# EAGLE design sa_input (EAGLE 9.6.2)
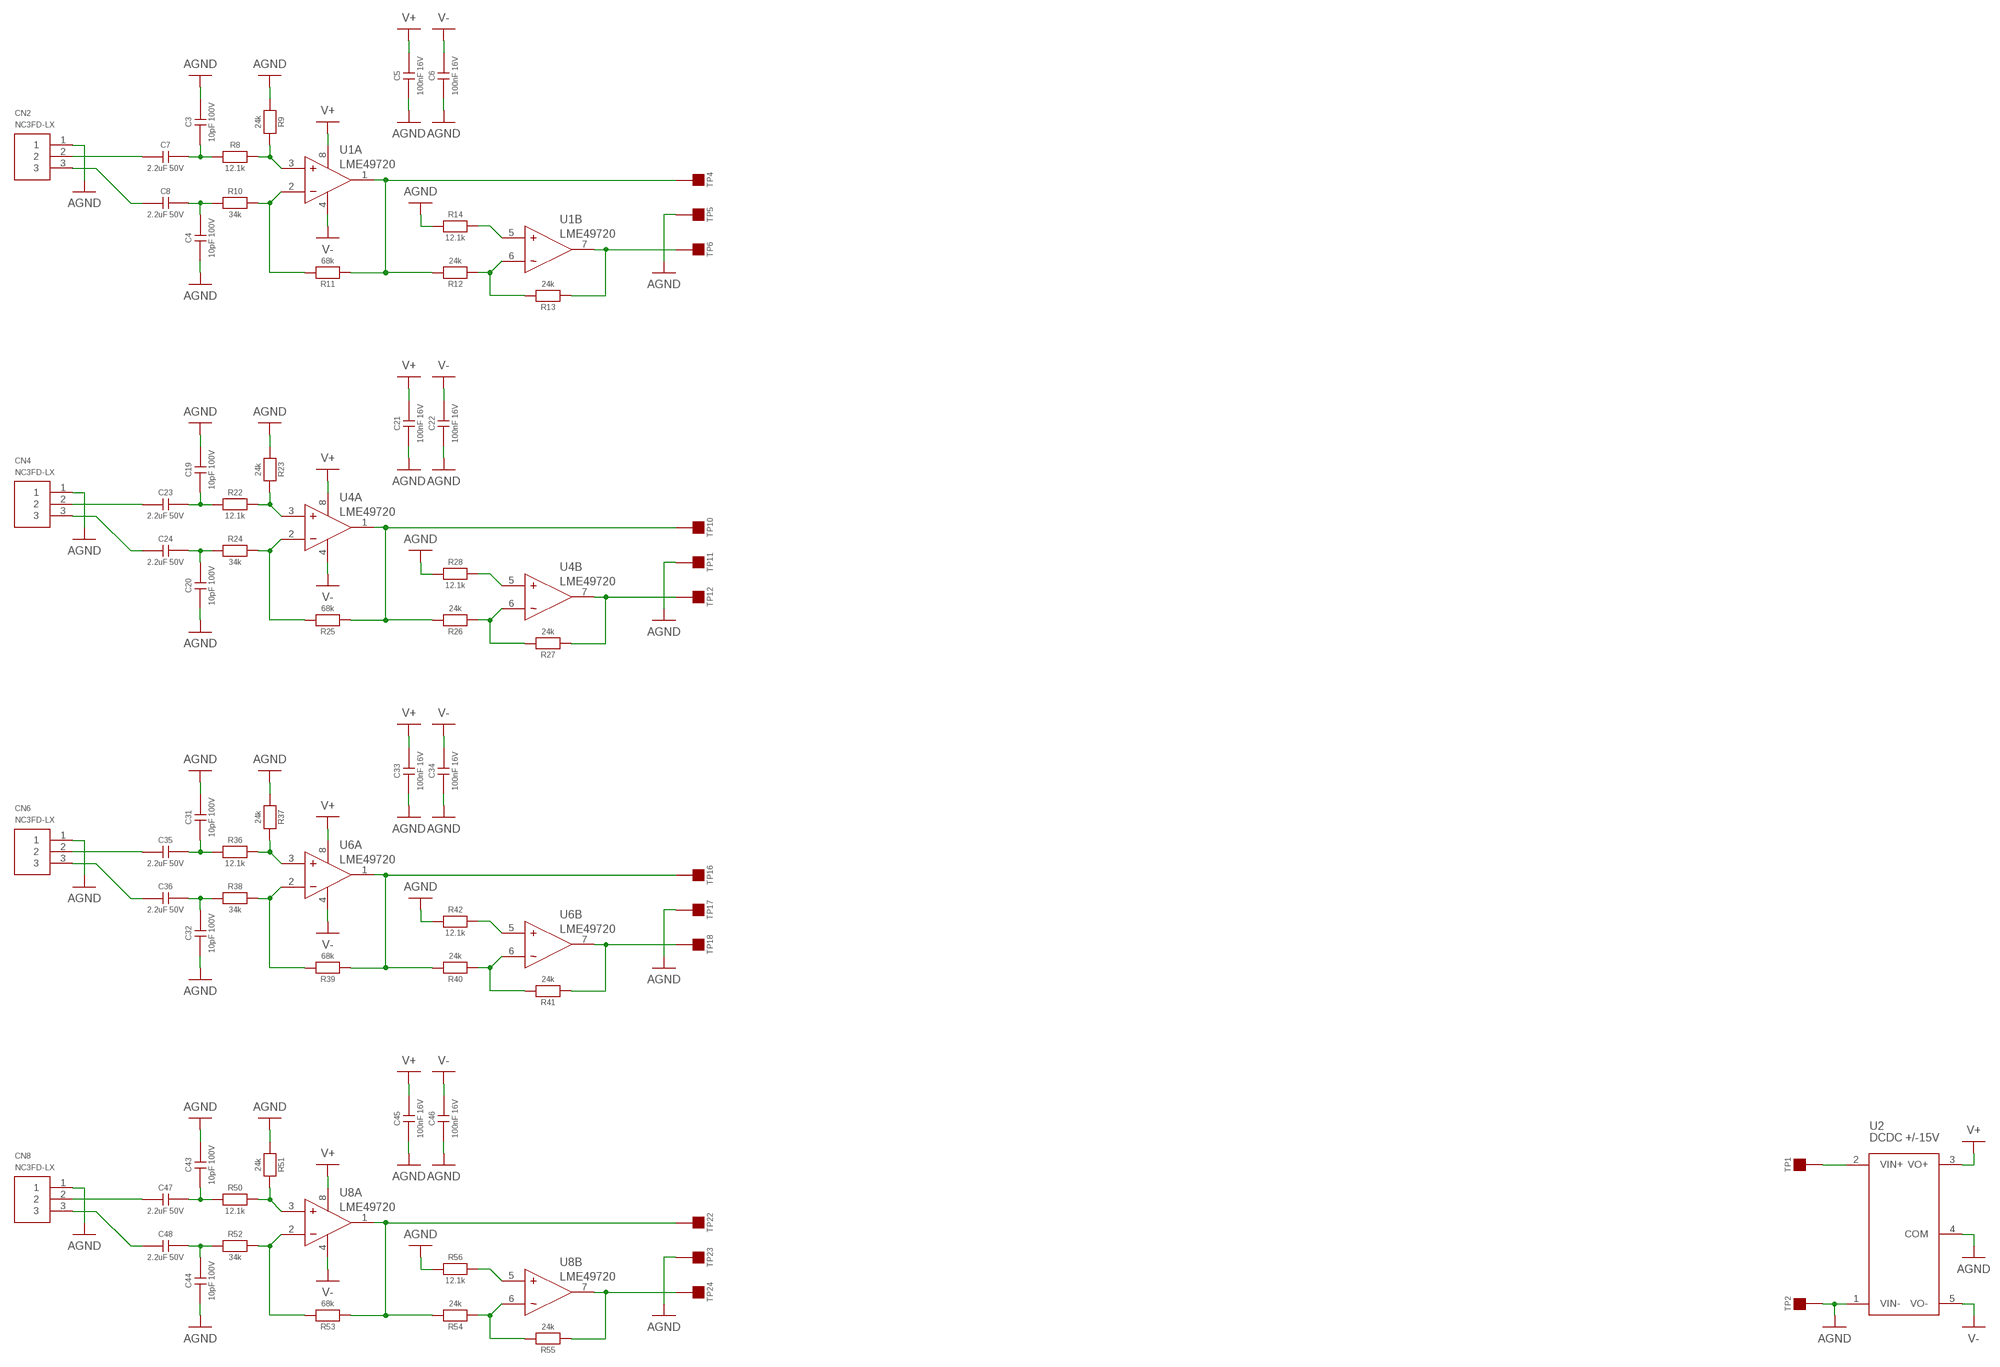
[diagram p0: schematic, sheet 1, part 1 of 2]
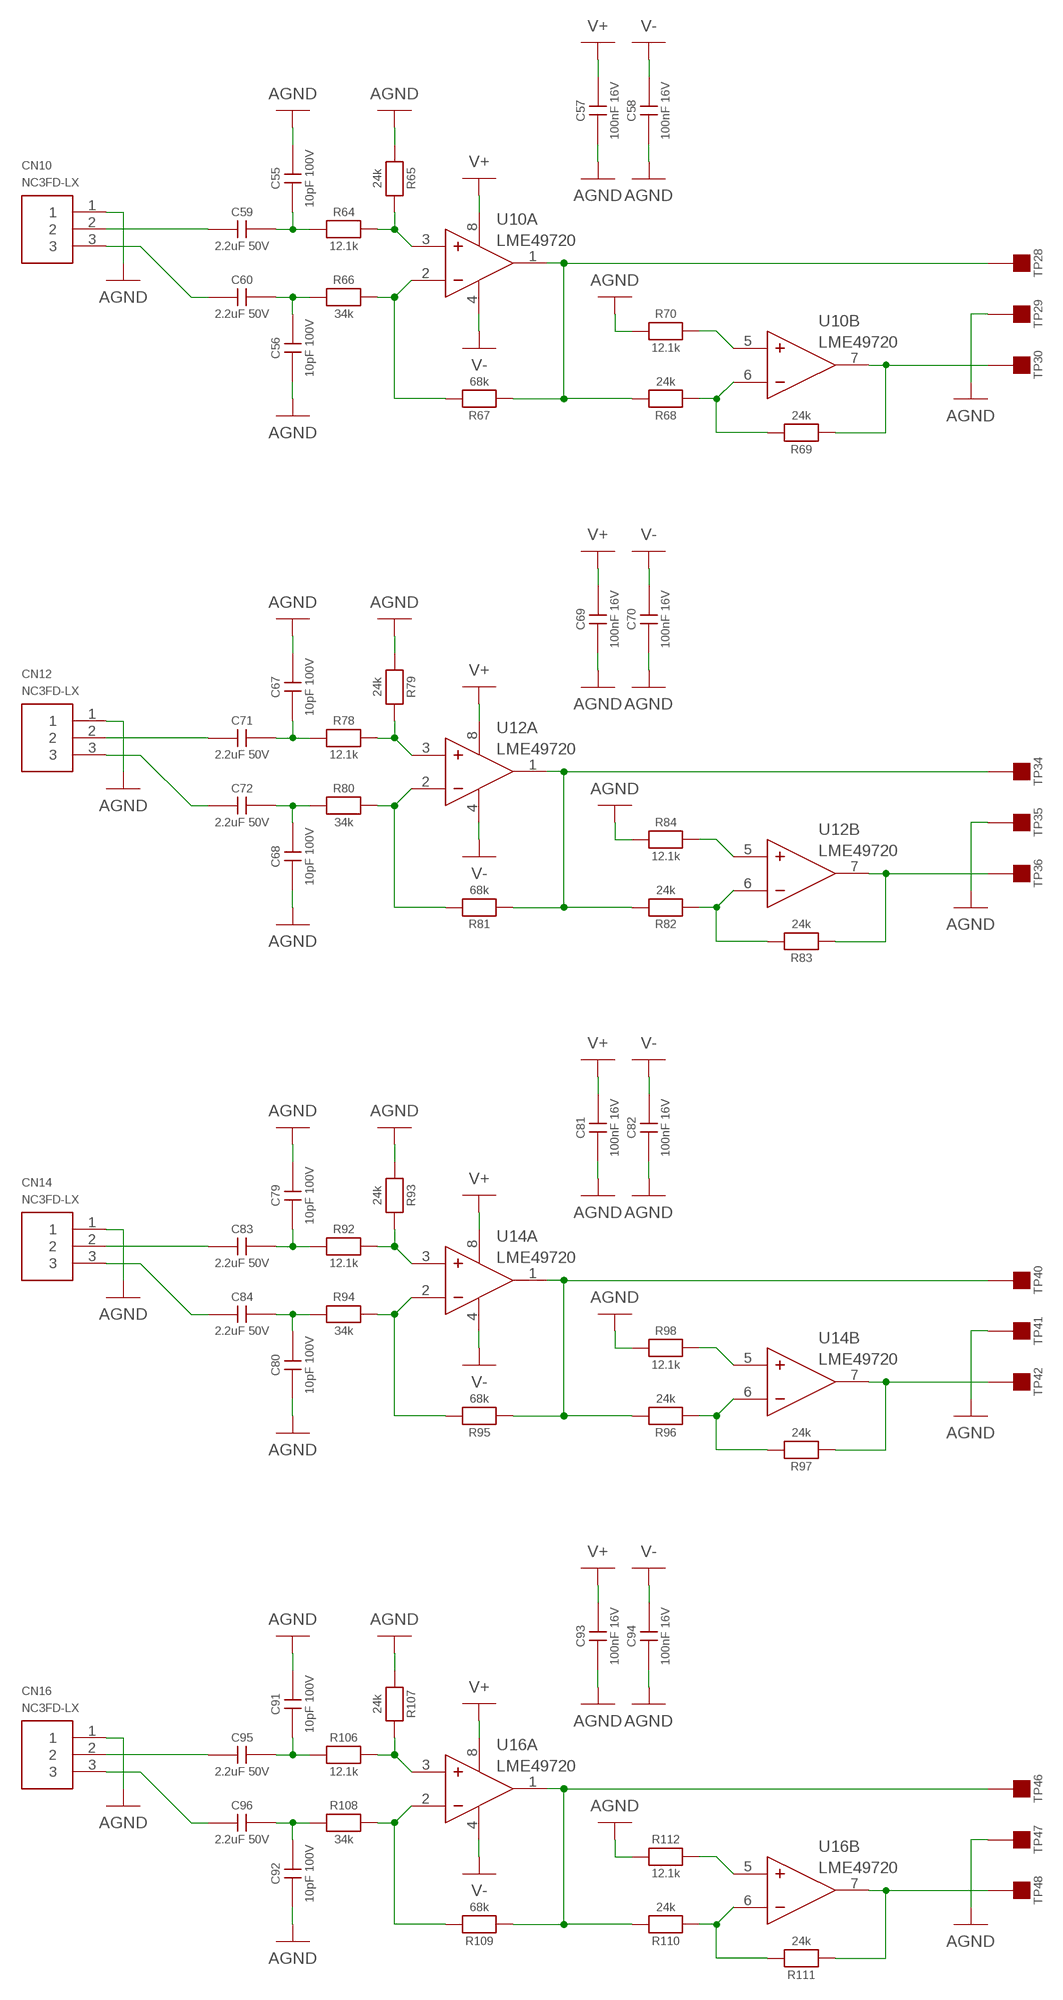
[diagram p1: schematic, sheet 1, part 2 of 2]

## Parts
C3  10pF 100V  06031A100FAT2A  [0603]
C4  10pF 100V  06031A100FAT2A  [0603]
C5  100nF 16V  CL10B104KO8WPNC  [0603]
C6  100nF 16V  CL10B104KO8WPNC  [0603]
C7  2.2uF 50V  MKS2B042201F00KSSD  [5X7.2BOX]
C8  2.2uF 50V  MKS2B042201F00KSSD  [5X7.2BOX]
C19  10pF 100V  06031A100FAT2A  [0603]
C20  10pF 100V  06031A100FAT2A  [0603]
C21  100nF 16V  CL10B104KO8WPNC  [0603]
C22  100nF 16V  CL10B104KO8WPNC  [0603]
C23  2.2uF 50V  MKS2B042201F00KSSD  [5X7.2BOX]
C24  2.2uF 50V  MKS2B042201F00KSSD  [5X7.2BOX]
C31  10pF 100V  06031A100FAT2A  [0603]
C32  10pF 100V  06031A100FAT2A  [0603]
C33  100nF 16V  CL10B104KO8WPNC  [0603]
C34  100nF 16V  CL10B104KO8WPNC  [0603]
C35  2.2uF 50V  MKS2B042201F00KSSD  [5X7.2BOX]
C36  2.2uF 50V  MKS2B042201F00KSSD  [5X7.2BOX]
C43  10pF 100V  06031A100FAT2A  [0603]
C44  10pF 100V  06031A100FAT2A  [0603]
C45  100nF 16V  CL10B104KO8WPNC  [0603]
C46  100nF 16V  CL10B104KO8WPNC  [0603]
C47  2.2uF 50V  MKS2B042201F00KSSD  [5X7.2BOX]
C48  2.2uF 50V  MKS2B042201F00KSSD  [5X7.2BOX]
C55  10pF 100V  06031A100FAT2A  [0603]
C56  10pF 100V  06031A100FAT2A  [0603]
C57  100nF 16V  CL10B104KO8WPNC  [0603]
C58  100nF 16V  CL10B104KO8WPNC  [0603]
C59  2.2uF 50V  MKS2B042201F00KSSD  [5X7.2BOX]
C60  2.2uF 50V  MKS2B042201F00KSSD  [5X7.2BOX]
C67  10pF 100V  06031A100FAT2A  [0603]
C68  10pF 100V  06031A100FAT2A  [0603]
C69  100nF 16V  CL10B104KO8WPNC  [0603]
C70  100nF 16V  CL10B104KO8WPNC  [0603]
C71  2.2uF 50V  MKS2B042201F00KSSD  [5X7.2BOX]
C72  2.2uF 50V  MKS2B042201F00KSSD  [5X7.2BOX]
C79  10pF 100V  06031A100FAT2A  [0603]
C80  10pF 100V  06031A100FAT2A  [0603]
C81  100nF 16V  CL10B104KO8WPNC  [0603]
C82  100nF 16V  CL10B104KO8WPNC  [0603]
C83  2.2uF 50V  MKS2B042201F00KSSD  [5X7.2BOX]
C84  2.2uF 50V  MKS2B042201F00KSSD  [5X7.2BOX]
C91  10pF 100V  06031A100FAT2A  [0603]
C92  10pF 100V  06031A100FAT2A  [0603]
C93  100nF 16V  CL10B104KO8WPNC  [0603]
C94  100nF 16V  CL10B104KO8WPNC  [0603]
C95  2.2uF 50V  MKS2B042201F00KSSD  [5X7.2BOX]
C96  2.2uF 50V  MKS2B042201F00KSSD  [5X7.2BOX]
CN2  NC3FD-LX  [NC3FD-LX]
CN4  NC3FD-LX  [NC3FD-LX]
CN6  NC3FD-LX  [NC3FD-LX]
CN8  NC3FD-LX  [NC3FD-LX]
CN10  NC3FD-LX  [NC3FD-LX]
CN12  NC3FD-LX  [NC3FD-LX]
CN14  NC3FD-LX  [NC3FD-LX]
CN16  NC3FD-LX  [NC3FD-LX]
R8  12.1k  CRCW060312K1FKEB  [0603]
R9  24k  CRCW060324K0FKEA  [0603]
R10  34k  CRCW060334K0FKEA  [0603]
R11  68k  CRCW060368K0FKEA  [0603]
R12  24k  CRCW060324K0FKEA  [0603]
R13  24k  CRCW060324K0FKEA  [0603]
R14  12.1k  CRCW060312K1FKEB  [0603]
R22  12.1k  CRCW060312K1FKEB  [0603]
R23  24k  CRCW060324K0FKEA  [0603]
R24  34k  CRCW060334K0FKEA  [0603]
R25  68k  CRCW060368K0FKEA  [0603]
R26  24k  CRCW060324K0FKEA  [0603]
R27  24k  CRCW060324K0FKEA  [0603]
R28  12.1k  CRCW060312K1FKEB  [0603]
R36  12.1k  CRCW060312K1FKEB  [0603]
R37  24k  CRCW060324K0FKEA  [0603]
R38  34k  CRCW060334K0FKEA  [0603]
R39  68k  CRCW060368K0FKEA  [0603]
R40  24k  CRCW060324K0FKEA  [0603]
R41  24k  CRCW060324K0FKEA  [0603]
R42  12.1k  CRCW060312K1FKEB  [0603]
R50  12.1k  CRCW060312K1FKEB  [0603]
R51  24k  CRCW060324K0FKEA  [0603]
R52  34k  CRCW060334K0FKEA  [0603]
R53  68k  CRCW060368K0FKEA  [0603]
R54  24k  CRCW060324K0FKEA  [0603]
R55  24k  CRCW060324K0FKEA  [0603]
R56  12.1k  CRCW060312K1FKEB  [0603]
R64  12.1k  CRCW060312K1FKEB  [0603]
R65  24k  CRCW060324K0FKEA  [0603]
R66  34k  CRCW060334K0FKEA  [0603]
R67  68k  CRCW060368K0FKEA  [0603]
R68  24k  CRCW060324K0FKEA  [0603]
R69  24k  CRCW060324K0FKEA  [0603]
R70  12.1k  CRCW060312K1FKEB  [0603]
R78  12.1k  CRCW060312K1FKEB  [0603]
R79  24k  CRCW060324K0FKEA  [0603]
R80  34k  CRCW060334K0FKEA  [0603]
R81  68k  CRCW060368K0FKEA  [0603]
R82  24k  CRCW060324K0FKEA  [0603]
R83  24k  CRCW060324K0FKEA  [0603]
R84  12.1k  CRCW060312K1FKEB  [0603]
R92  12.1k  CRCW060312K1FKEB  [0603]
R93  24k  CRCW060324K0FKEA  [0603]
R94  34k  CRCW060334K0FKEA  [0603]
R95  68k  CRCW060368K0FKEA  [0603]
R96  24k  CRCW060324K0FKEA  [0603]
R97  24k  CRCW060324K0FKEA  [0603]
R98  12.1k  CRCW060312K1FKEB  [0603]
R106  12.1k  CRCW060312K1FKEB  [0603]
R107  24k  CRCW060324K0FKEA  [0603]
R108  34k  CRCW060334K0FKEA  [0603]
R109  68k  CRCW060368K0FKEA  [0603]
R110  24k  CRCW060324K0FKEA  [0603]
R111  24k  CRCW060324K0FKEA  [0603]
R112  12.1k  CRCW060312K1FKEB  [0603]
TP1  TEST_POINT_SQUARE  [OSPREY_HSS_PAD]
TP2  TEST_POINT_SQUARE  [OSPREY_HSS_PAD]
TP4  TEST_POINT_SQUARE  [OSPREY_HSS_PAD]
TP5  TEST_POINT_SQUARE  [OSPREY_HSS_PAD]
TP6  TEST_POINT_SQUARE  [OSPREY_HSS_PAD]
TP10  TEST_POINT_SQUARE  [OSPREY_HSS_PAD]
TP11  TEST_POINT_SQUARE  [OSPREY_HSS_PAD]
TP12  TEST_POINT_SQUARE  [OSPREY_HSS_PAD]
TP16  TEST_POINT_SQUARE  [OSPREY_HSS_PAD]
TP17  TEST_POINT_SQUARE  [OSPREY_HSS_PAD]
TP18  TEST_POINT_SQUARE  [OSPREY_HSS_PAD]
TP22  TEST_POINT_SQUARE  [OSPREY_HSS_PAD]
TP23  TEST_POINT_SQUARE  [OSPREY_HSS_PAD]
TP24  TEST_POINT_SQUARE  [OSPREY_HSS_PAD]
TP28  TEST_POINT_SQUARE  [OSPREY_HSS_PAD]
TP29  TEST_POINT_SQUARE  [OSPREY_HSS_PAD]
TP30  TEST_POINT_SQUARE  [OSPREY_HSS_PAD]
TP34  TEST_POINT_SQUARE  [OSPREY_HSS_PAD]
TP35  TEST_POINT_SQUARE  [OSPREY_HSS_PAD]
TP36  TEST_POINT_SQUARE  [OSPREY_HSS_PAD]
TP40  TEST_POINT_SQUARE  [OSPREY_HSS_PAD]
TP41  TEST_POINT_SQUARE  [OSPREY_HSS_PAD]
TP42  TEST_POINT_SQUARE  [OSPREY_HSS_PAD]
TP46  TEST_POINT_SQUARE  [OSPREY_HSS_PAD]
TP47  TEST_POINT_SQUARE  [OSPREY_HSS_PAD]
TP48  TEST_POINT_SQUARE  [OSPREY_HSS_PAD]
U1  LME49720  LME49720MA/NOPB  [SO8]
U2  DCDC +/-15V  PDQE10-Q48-D15-D  [PDQE10]
U4  LME49720  LME49720MA/NOPB  [SO8]
U6  LME49720  LME49720MA/NOPB  [SO8]
U8  LME49720  LME49720MA/NOPB  [SO8]
U10  LME49720  LME49720MA/NOPB  [SO8]
U12  LME49720  LME49720MA/NOPB  [SO8]
U14  LME49720  LME49720MA/NOPB  [SO8]
U16  LME49720  LME49720MA/NOPB  [SO8]

## Nets
AGND: C3.1 C4.1 C5.1 C6.1 C19.1 C20.1 C21.1 C22.1 C31.1 C32.1 C33.1 C34.1 C43.1 C44.1 C45.1 C46.1 C55.1 C56.1 C57.1 C58.1 C67.1 C68.1 C69.1 C70.1 C79.1 C80.1 C81.1 C82.1 C91.1 C92.1 C93.1 C94.1 CN2.1 CN4.1 CN6.1 CN8.1 CN10.1 CN12.1 CN14.1 CN16.1 R9.1 R14.1 R23.1 R28.1 R37.1 R42.1 R51.1 R56.1 R65.1 R70.1 R79.1 R84.1 R93.1 R98.1 R107.1 R112.1 TP2.1 TP5.1 TP11.1 TP17.1 TP23.1 TP29.1 TP35.1 TP41.1 TP47.1 U2.1(VIN-) U2.4(COM)
N$1: TP1.1 U2.2(VIN+)
N$9: R8.2 R9.2 U1.3(A:+)
N$10: R10.2 R11.2 U1.2(A:-)
N$11: C3.2 C7.2 R8.1
N$12: C4.2 C8.2 R10.1
N$13: C7.1 CN2.2
N$14: C8.1 CN2.3
N$15: R12.1 R13.2 U1.6(B:-)
N$16: R14.2 U1.5(B:+)
N$25: R22.2 R23.2 U4.3(A:+)
N$26: R24.2 R25.2 U4.2(A:-)
N$27: C19.2 C23.2 R22.1
N$28: C20.2 C24.2 R24.1
N$29: C23.1 CN4.2
N$30: C24.1 CN4.3
N$31: R26.1 R27.2 U4.6(B:-)
N$32: R28.2 U4.5(B:+)
N$41: R36.2 R37.2 U6.3(A:+)
N$42: R38.2 R39.2 U6.2(A:-)
N$43: C31.2 C35.2 R36.1
N$44: C32.2 C36.2 R38.1
N$45: C35.1 CN6.2
N$46: C36.1 CN6.3
N$47: R40.1 R41.2 U6.6(B:-)
N$48: R42.2 U6.5(B:+)
N$57: R50.2 R51.2 U8.3(A:+)
N$58: R52.2 R53.2 U8.2(A:-)
N$59: C43.2 C47.2 R50.1
N$60: C44.2 C48.2 R52.1
N$61: C47.1 CN8.2
N$62: C48.1 CN8.3
N$63: R54.1 R55.2 U8.6(B:-)
N$64: R56.2 U8.5(B:+)
N$73: R64.2 R65.2 U10.3(A:+)
N$74: R66.2 R67.2 U10.2(A:-)
N$75: C55.2 C59.2 R64.1
N$76: C56.2 C60.2 R66.1
N$77: C59.1 CN10.2
N$78: C60.1 CN10.3
N$79: R68.1 R69.2 U10.6(B:-)
N$80: R70.2 U10.5(B:+)
N$89: R78.2 R79.2 U12.3(A:+)
N$90: R80.2 R81.2 U12.2(A:-)
N$91: C67.2 C71.2 R78.1
N$92: C68.2 C72.2 R80.1
N$93: C71.1 CN12.2
N$94: C72.1 CN12.3
N$95: R82.1 R83.2 U12.6(B:-)
N$96: R84.2 U12.5(B:+)
N$105: R92.2 R93.2 U14.3(A:+)
N$106: R94.2 R95.2 U14.2(A:-)
N$107: C79.2 C83.2 R92.1
N$108: C80.2 C84.2 R94.1
N$109: C83.1 CN14.2
N$110: C84.1 CN14.3
N$111: R96.1 R97.2 U14.6(B:-)
N$112: R98.2 U14.5(B:+)
N$121: R106.2 R107.2 U16.3(A:+)
N$122: R108.2 R109.2 U16.2(A:-)
N$123: C91.2 C95.2 R106.1
N$124: C92.2 C96.2 R108.1
N$125: C95.1 CN16.2
N$126: C96.1 CN16.3
N$127: R110.1 R111.2 U16.6(B:-)
N$128: R112.2 U16.5(B:+)
V+: C5.2 C21.2 C33.2 C45.2 C57.2 C69.2 C81.2 C93.2 U1.8(A:V+) U2.3(VO+) U4.8(A:V+) U6.8(A:V+) U8.8(A:V+) U10.8(A:V+) U12.8(A:V+) U14.8(A:V+) U16.8(A:V+)
V-: C6.2 C22.2 C34.2 C46.2 C58.2 C70.2 C82.2 C94.2 U1.4(A:V-) U2.5(VO-) U4.4(A:V-) U6.4(A:V-) U8.4(A:V-) U10.4(A:V-) U12.4(A:V-) U14.4(A:V-) U16.4(A:V-)
VOUT_N_1: R13.1 TP6.1 U1.7(B:OUT)
VOUT_N_3: R27.1 TP12.1 U4.7(B:OUT)
VOUT_N_5: R41.1 TP18.1 U6.7(B:OUT)
VOUT_N_7: R55.1 TP24.1 U8.7(B:OUT)
VOUT_N_9: R69.1 TP30.1 U10.7(B:OUT)
VOUT_N_11: R83.1 TP36.1 U12.7(B:OUT)
VOUT_N_13: R97.1 TP42.1 U14.7(B:OUT)
VOUT_N_15: R111.1 TP48.1 U16.7(B:OUT)
VOUT_P_1: R11.1 R12.2 TP4.1 U1.1(A:OUT)
VOUT_P_3: R25.1 R26.2 TP10.1 U4.1(A:OUT)
VOUT_P_5: R39.1 R40.2 TP16.1 U6.1(A:OUT)
VOUT_P_7: R53.1 R54.2 TP22.1 U8.1(A:OUT)
VOUT_P_9: R67.1 R68.2 TP28.1 U10.1(A:OUT)
VOUT_P_11: R81.1 R82.2 TP34.1 U12.1(A:OUT)
VOUT_P_13: R95.1 R96.2 TP40.1 U14.1(A:OUT)
VOUT_P_15: R109.1 R110.2 TP46.1 U16.1(A:OUT)

## Library data of the parts
C3 C4 C19 C20 C31 C32 C43 C44 C55 C56 C67 C68 C79 C80 C91 C92 = CAPACITORS:06031A100FAT2A: 10pF 100V C0G/NP0 1% 0603 MLCC.; DIGIKEY: 478-5769-1-ND; HEIGHT: 1; PRICE_PER: 0.23
C5 C6 C21 C22 C33 C34 C45 C46 C57 C58 C69 C70 C81 C82 C93 C94 = CAPACITORS:CL10B104KO8WPNC: 100nF 16V X7R 10% 0603 MLCC; DIGIKEY: 1276-6582-1-ND; HEIGHT: 1; PRICE_PER: 0.08
C7 C8 C23 C24 C35 C36 C47 C48 C59 C60 C71 C72 C83 C84 C95 C96 = CAPACITORS:MKS2B042201F00KSSD: 2.2uF 50V FILM 10% 7.2 x 5mm BOX; FARNELL: 107422; HEIGHT: 10; PRICE_PER: 1.28
CN2 CN4 CN6 CN8 CN10 CN12 CN14 CN16 = CONNECTORs:NC3FD-LX: XLR Connector, 3 Contacts, Socket, Panel Mount, Silver Plated Contacts, Metal Body, DLX; FARNELL: 1390116; HEIGHT: 24; PRICE_PER: 4.68
R8 R14 R22 R28 R36 R42 R50 R56 R64 R70 R78 R84 R92 R98 R106 R112 = r_0603:CRCW060312K1FKEB: 12100 ±1% 12.1k Thick Film 0.1W, 1/10W 0603; DIGIKEY: 541-CRCW060312K1FKEBCT-ND; HEIGHT: 1; MANUFACTURER: Vishay Dale; POWER: 0.1W, 1/10W; PRICE_PER: 0.07000; STOCK: 10866; TOLERANCE: ±1%
R9 R12 R13 R23 R26 R27 R37 R40 R41 R51 R54 R55 R65 R68 R69 R79 R82 R83 R93 R96 R97 R107 R110 R111 = r_0603:CRCW060324K0FKEA: 24000 ±1% 24k Thick Film 0.1W, 1/10W 0603; DIGIKEY: 541-24.0KHCT-ND; HEIGHT: 1; MANUFACTURER: Vishay Dale; POWER: 0.1W, 1/10W; PRICE_PER: 0.07000; STOCK: 989; TOLERANCE: ±1%
R10 R24 R38 R52 R66 R80 R94 R108 = r_0603:CRCW060334K0FKEA: 34000 ±1% 34k Thick Film 0.1W, 1/10W 0603; DIGIKEY: 541-34.0KHCT-ND; HEIGHT: 1; MANUFACTURER: Vishay Dale; POWER: 0.1W, 1/10W; PRICE_PER: 0.07000; STOCK: 19900; TOLERANCE: ±1%
R11 R25 R39 R53 R67 R81 R95 R109 = r_0603:CRCW060368K0FKEA: 68000 ±1% 68k Thick Film 0.1W, 1/10W 0603; DIGIKEY: 541-68.0KHCT-ND; HEIGHT: 1; MANUFACTURER: Vishay Dale; POWER: 0.1W, 1/10W; PRICE_PER: 0.07000; STOCK: 14428; TOLERANCE: ±1%
TP1 TP2 TP4-TP6 TP10-TP12 TP16-TP18 TP22-TP24 TP28-TP30 TP34-TP36 TP40-TP42 TP46-TP48 = MISC:TEST_POINT_SQUARE: A square pad initially made for the HSS wiring
U1 U4 U6 U8 U10 U12 U14 U16 = ICs:LME49720: LME49720 Dual High Performance, High Fidelity Audio Operational Amplifier. 0.00003% THD, +/-17V.; FARNELL: 1564794; PRICE_PER: 2.15
U2 = ICs:PDQE10-Q48-D15-D: Isolated Module DC DC Converter 2 Output 15V -15V 333mA, 333mA 18V - 75V Input; DIGIKEY: 102-4868-ND; HEIGHT: 12; PRICE_PER: 13.64

## Board
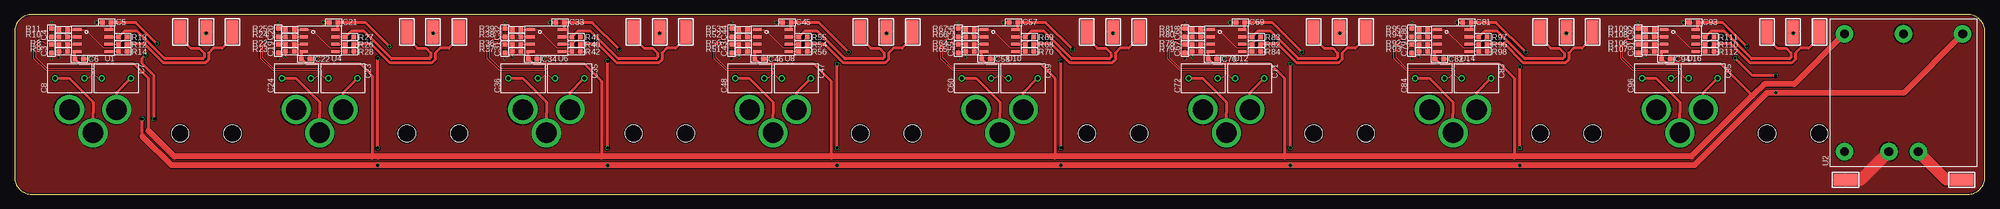
[diagram p2: board, top side]
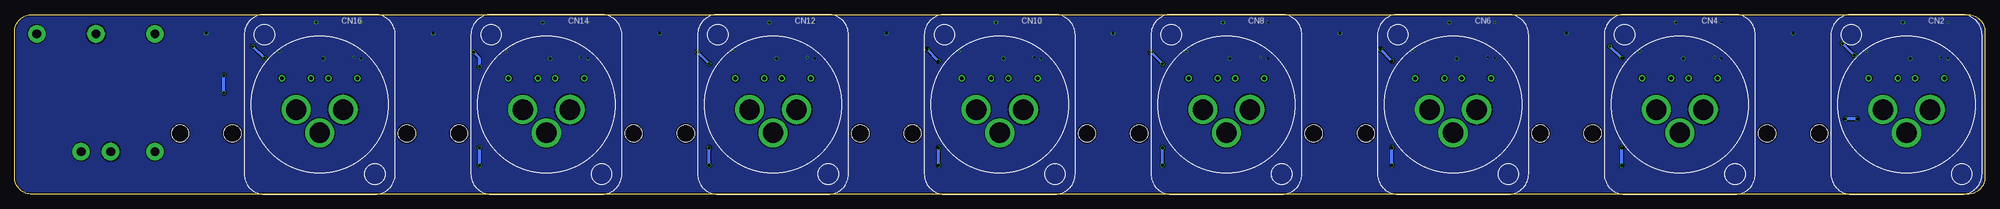
[diagram p3: board, bottom side, seen from below]

Size 339 x 31 mm. Coordinates in mm from the lower left corner, seen from the top.
Outline: 3,0 336,0 arc90 339,3 339,28 arc90 336,31 3,31 arc90 0,28 0,3 arc90 3,0
Copper layers (1*2*3*16): Top 0.035mm / dielectric 0.15mm / Route2 0.035mm / dielectric 1.11mm / Route3 0.035mm / dielectric 0.2mm / Bottom 0.035mm
Design rules "myDRC 4 layers 0.15mm": minimum track width 0.15mm, minimum drill 0.25mm, track to track 0.15mm, track to pad 0.15mm, pad to pad 0.15mm, via to via 0.15mm, smd to smd 0mil, copper to edge 0.25mm, drill to drill 0.25mm, minimum pad ring 10mil, minimum via ring 3mil, stop-mask expansion 4mil, vias tented up to drill 1mm, thermal gap 10mil
Holes 3 mm at 28.5,10.5 37.5,10.5 67.5,10.5 76.5,10.5 106.5,10.5 115.5,10.5 145.5,10.5 154.5,10.5 184.5,10.5 193.5,10.5 223.5,10.5 232.5,10.5 262.5,10.5 271.5,10.5 301.5,10.5 310.5,10.5

### Footprints (pad centres in the part's own frame; a part is rotated, then mirrored left to right if it is on the bottom)
0603 = smd 0.8 x 0.8: 1 -0.75,0; 2 0.75,0
5X7.2BOX = drill 0.6: 1 -2.5,0; 2 2.5,0
NC3FD-LX = drill 3.5 pad 5: 1 4.05,-0.9; 2 -4.05,-0.9; 3 0,-4.9
OSPREY_HSS_PAD = smd 4 x 2: 1 0,0
SO8 = smd 1.5 x 0.55: 1 -2.7,1.875; 2 -2.7,0.625; 3 -2.7,-0.625; 4 -2.7,-1.875; 5 2.7,-1.875; 6 2.7,-0.625; 7 2.7,0.625; 8 2.7,1.875
PDQE10 = drill 1.5 pad 3: 1 2.54,10.16; 2 -2.54,10.16; 3 -10.16,-10.16; 4 0,-10.16; 5 10.16,-10.16; 6 10.16,10.16

### Placement (x,y rotation side)
C3  6.38,25.12 90 top
C4  6.38,27.88 270 top
C5  15.88,29.62 0 top
C6  11.12,23.38 180 top
C7  17.5,20 180 top
C8  9.5,20 0 top
C19  45.38,25.12 90 top
C20  45.38,27.88 270 top
C21  54.88,29.62 0 top
C22  50.12,23.38 180 top
C23  56.5,20 180 top
C24  48.5,20 0 top
C31  84.38,25.12 90 top
C32  84.38,27.88 270 top
C33  93.88,29.62 0 top
C34  89.12,23.38 180 top
C35  95.5,20 180 top
C36  87.5,20 0 top
C43  123.38,25.12 90 top
C44  123.38,27.88 270 top
C45  132.88,29.62 0 top
C46  128.12,23.38 180 top
C47  134.5,20 180 top
C48  126.5,20 0 top
C55  162.38,25.12 90 top
C56  162.38,27.88 270 top
C57  171.88,29.62 0 top
C58  167.12,23.38 180 top
C59  173.5,20 180 top
C60  165.5,20 0 top
C67  201.38,25.12 90 top
C68  201.38,27.88 270 top
C69  210.88,29.62 0 top
C70  206.12,23.38 180 top
C71  212.5,20 180 top
C72  204.5,20 0 top
C79  240.38,25.12 90 top
C80  240.38,27.88 270 top
C81  249.88,29.62 0 top
C82  245.12,23.38 180 top
C83  251.5,20 180 top
C84  243.5,20 0 top
C91  279.38,25.12 90 top
C92  279.38,27.88 270 top
C93  288.88,29.62 0 top
C94  284.12,23.38 180 top
C95  290.5,20 180 top
C96  282.5,20 0 top
CN2  13.5,15.5 0 bottom
CN4  52.5,15.5 0 bottom
CN6  91.5,15.5 0 bottom
CN8  130.5,15.5 0 bottom
CN10  169.5,15.5 0 bottom
CN12  208.5,15.5 0 bottom
CN14  247.5,15.5 0 bottom
CN16  286.5,15.5 0 bottom
R8  8.38,25.88 0 top
R9  8.38,24.62 0 top
R10  8.38,27.12 0 top
R11  8.38,28.38 180 top
R12  18.62,25.88 0 top
R13  18.62,27.12 0 top
R14  18.62,24.62 180 top
R22  47.38,25.88 0 top
R23  47.38,24.62 0 top
R24  47.38,27.12 0 top
R25  47.38,28.38 180 top
R26  57.62,25.88 0 top
R27  57.62,27.12 0 top
R28  57.62,24.62 180 top
R36  86.38,25.88 0 top
R37  86.38,24.62 0 top
R38  86.38,27.12 0 top
R39  86.38,28.38 180 top
R40  96.62,25.88 0 top
R41  96.62,27.12 0 top
R42  96.62,24.62 180 top
R50  125.38,25.88 0 top
R51  125.38,24.62 0 top
R52  125.38,27.12 0 top
R53  125.38,28.38 180 top
R54  135.62,25.88 0 top
R55  135.62,27.12 0 top
R56  135.62,24.62 180 top
R64  164.38,25.88 0 top
R65  164.38,24.62 0 top
R66  164.38,27.12 0 top
R67  164.38,28.38 180 top
R68  174.62,25.88 0 top
R69  174.62,27.12 0 top
R70  174.62,24.62 180 top
R78  203.38,25.88 0 top
R79  203.38,24.62 0 top
R80  203.38,27.12 0 top
R81  203.38,28.38 180 top
R82  213.62,25.88 0 top
R83  213.62,27.12 0 top
R84  213.62,24.62 180 top
R92  242.38,25.88 0 top
R93  242.38,24.62 0 top
R94  242.38,27.12 0 top
R95  242.38,28.38 180 top
R96  252.62,25.88 0 top
R97  252.62,27.12 0 top
R98  252.62,24.62 180 top
R106  281.38,25.88 0 top
R107  281.38,24.62 0 top
R108  281.38,27.12 0 top
R109  281.38,28.38 180 top
R110  291.62,25.88 0 top
R111  291.62,27.12 0 top
R112  291.62,24.62 180 top
TP1  335,2.5 0 top
TP2  315,2.5 0 top
TP4  37.5,28 90 top
TP5  33,28 90 top
TP6  28.5,28 90 top
TP10  76.5,28 90 top
TP11  72,28 90 top
TP12  67.5,28 90 top
TP16  115.5,28 90 top
TP17  111,28 90 top
TP18  106.5,28 90 top
TP22  154.5,28 90 top
TP23  150,28 90 top
TP24  145.5,28 90 top
TP28  193.5,28 90 top
TP29  189,28 90 top
TP30  184.5,28 90 top
TP34  232.5,28 90 top
TP35  228,28 90 top
TP36  223.5,28 90 top
TP40  271.5,28 90 top
TP41  267,28 90 top
TP42  262.5,28 90 top
TP46  310.5,28 90 top
TP47  306,28 90 top
TP48  301.5,28 90 top
U1  13.5,26.5 0 top
U2  325,17.5 180 top
U4  52.5,26.5 0 top
U6  91.5,26.5 0 top
U8  130.5,26.5 0 top
U10  169.5,26.5 0 top
U12  208.5,26.5 0 top
U14  247.5,26.5 0 top
U16  286.5,26.5 0 top

### Tracks (layer width: path | path; a pad name or v marks a point on that pad's centre or on a via)
AGND  (via drill 0.3, 0.5)
  Top 0.15: R9.1 v7.62,23.62 | C4.1 v6.38,29.62 | C3.1 v6.38,23.38 | R14.1 v20.38,24.62 | R23.1 v46.62,23.62 | C20.1 v45.38,29.62 | C19.1 v45.38,23.38 | R28.1 v59.38,24.62 | R37.1 v85.62,23.62 | C32.1 v84.38,29.62 | C31.1 v84.38,23.38 | R42.1 v98.38,24.62 | R51.1 v124.62,23.62 | C44.1 v123.38,29.62 | C43.1 v123.38,23.38 | R56.1 v137.38,24.62 | R65.1 v163.62,23.62 | C56.1 v162.38,29.62 | C55.1 v162.38,23.38 | R70.1 v176.38,24.62 | R79.1 v202.62,23.62 | C68.1 v201.38,29.62 | C67.1 v201.38,23.38 | R84.1 v215.38,24.62 | R93.1 v241.62,23.62 | C80.1 v240.38,29.62 | C79.1 v240.38,23.38 | R98.1 v254.38,24.62 | R107.1 v280.62,23.62 | C92.1 v279.38,29.62 | C91.1 v279.38,23.38 | R112.1 v293.38,24.62
  Top 0.5: C5.1 v14.12,29.62 | C6.1 v12.88,23.38 | TP5.1 v33,27.75 | C21.1 v53.12,29.62 | C22.1 v51.88,23.38 | TP11.1 v72,27.75 | C33.1 v92.12,29.62 | C34.1 v90.88,23.38 | TP17.1 v111,27.75 | C45.1 v131.12,29.62 | C46.1 v129.88,23.38 | TP23.1 v150,27.75 | C57.1 v170.12,29.62 | C58.1 v168.88,23.38 | TP29.1 v189,27.75 | C69.1 v209.12,29.62 | C70.1 v207.88,23.38 | TP35.1 v228,27.75 | C81.1 v248.12,29.62 | C82.1 v246.88,23.38 | TP41.1 v267,27.75 | C93.1 v287.12,29.62 | C94.1 v285.88,23.38 | TP47.1 v306,27.75
  Top 2: TP2.1 317.62,2.5 U2.1
  pour Bottom: -15,-15 360,-15 360,45 -15,45
  pour Top: -15,-15 360,-15 360,45 -15,45
N$1
  Top 2: TP1.1 332.38,2.5 U2.2
N$9
  Top 0.15: U1.3 R8.2 R9.2
N$10
  Top 0.15: R11.2 8.25,27.75 8.5,27.75 R10.2 U1.2
N$11
  Top 0.15: R8.1 C3.2 5.38,25.88 5,26.25 4.25,26.25 3.62,25.62 3.62,23.62 5.5,21.75 13.38,21.75 13.75,21.38 13.75,20.62 14.38,20 C7.2
N$12
  Top 0.15: R10.1 C4.2 5.5,27.12 5,26.62 4.12,26.62 3.25,25.75 3.25,23.5 5.38,21.38 13.25,21.38 13.38,21.25 13.38,20.62 12.75,20 C8.2
N$13
  Top 0.15: 17.55,17.55 17.56,17.56
  Top 0.5: 17.56,17.56 C7.1 | CN2.2 17.55,17.55
N$14
  Top 0.15: 13.5,13.88 13.5,14
  Top 0.5: 13.5,14 13.5,15.88 9.38,20 C8.1 | CN2.3 13.5,13.88
N$15
  Top 0.15: U1.6 R12.1 18.5,26.5 18.75,26.5 R13.2
N$16
  Top 0.15: R14.2 U1.5
N$25
  Top 0.15: U4.3 R22.2 R23.2
N$26
  Top 0.15: R25.2 47.25,27.75 47.5,27.75 R24.2 U4.2
N$27
  Top 0.15: R22.1 C19.2 44.38,25.88 44,26.25 43.25,26.25 42.62,25.62 42.62,23.62 44.5,21.75 52.38,21.75 52.75,21.38 52.75,20.62 53.38,20 C23.2
N$28
  Top 0.15: R24.1 C20.2 44.5,27.12 44,26.62 43.12,26.62 42.25,25.75 42.25,23.5 44.38,21.38 52.25,21.38 52.38,21.25 52.38,20.62 51.75,20 C24.2
N$29
  Top 0.15: 56.55,17.55 56.56,17.56
  Top 0.5: 56.56,17.56 C23.1 | CN4.2 56.55,17.55
N$30
  Top 0.15: 52.5,13.88 52.5,14
  Top 0.5: 52.5,14 52.5,15.88 48.38,20 C24.1 | CN4.3 52.5,13.88
N$31
  Top 0.15: U4.6 R26.1 57.5,26.5 57.75,26.5 R27.2
N$32
  Top 0.15: R28.2 U4.5
N$41
  Top 0.15: U6.3 R36.2 R37.2
N$42
  Top 0.15: R39.2 86.25,27.75 86.5,27.75 R38.2 U6.2
N$43
  Top 0.15: R36.1 C31.2 83.38,25.88 83,26.25 82.25,26.25 81.62,25.62 81.62,23.62 83.5,21.75 91.38,21.75 91.75,21.38 91.75,20.62 92.38,20 C35.2
N$44
  Top 0.15: R38.1 C32.2 83.5,27.12 83,26.62 82.12,26.62 81.25,25.75 81.25,23.5 83.38,21.38 91.25,21.38 91.38,21.25 91.38,20.62 90.75,20 C36.2
N$45
  Top 0.15: 95.55,17.55 95.56,17.56
  Top 0.5: 95.56,17.56 C35.1 | CN6.2 95.55,17.55
N$46
  Top 0.15: 91.5,13.88 91.5,14
  Top 0.5: 91.5,14 91.5,15.88 87.38,20 C36.1 | CN6.3 91.5,13.88
N$47
  Top 0.15: U6.6 R40.1 96.5,26.5 96.75,26.5 R41.2
N$48
  Top 0.15: R42.2 U6.5
N$57
  Top 0.15: U8.3 R50.2 R51.2
N$58
  Top 0.15: R53.2 125.25,27.75 125.5,27.75 R52.2 U8.2
N$59
  Top 0.15: R50.1 C43.2 122.38,25.88 122,26.25 121.25,26.25 120.62,25.62 120.62,23.62 122.5,21.75 130.38,21.75 130.75,21.38 130.75,20.62 131.38,20 C47.2
N$60
  Top 0.15: R52.1 C44.2 122.5,27.12 122,26.62 121.12,26.62 120.25,25.75 120.25,23.5 122.38,21.38 130.25,21.38 130.38,21.25 130.38,20.62 129.75,20 C48.2
N$61
  Top 0.15: 134.55,17.55 134.56,17.56
  Top 0.5: 134.56,17.56 C47.1 | CN8.2 134.55,17.55
N$62
  Top 0.15: 130.5,13.88 130.5,14
  Top 0.5: 130.5,14 130.5,15.88 126.38,20 C48.1 | CN8.3 130.5,13.88
N$63
  Top 0.15: U8.6 R54.1 135.5,26.5 135.75,26.5 R55.2
N$64
  Top 0.15: R56.2 U8.5
N$73
  Top 0.15: U10.3 R64.2 R65.2
N$74
  Top 0.15: R67.2 164.25,27.75 164.5,27.75 R66.2 U10.2
N$75
  Top 0.15: R64.1 C55.2 161.38,25.88 161,26.25 160.25,26.25 159.62,25.62 159.62,23.62 161.5,21.75 169.38,21.75 169.75,21.38 169.75,20.62 170.38,20 C59.2
N$76
  Top 0.15: R66.1 C56.2 161.5,27.12 161,26.62 160.12,26.62 159.25,25.75 159.25,23.5 161.38,21.38 169.25,21.38 169.38,21.25 169.38,20.62 168.75,20 C60.2
N$77
  Top 0.15: 173.55,17.55 173.56,17.56
  Top 0.5: 173.56,17.56 C59.1 | CN10.2 173.55,17.55
N$78
  Top 0.15: 169.5,13.88 169.5,14
  Top 0.5: 169.5,14 169.5,15.88 165.38,20 C60.1 | CN10.3 169.5,13.88
N$79
  Top 0.15: U10.6 R68.1 174.5,26.5 174.75,26.5 R69.2
N$80
  Top 0.15: R70.2 U10.5
N$89
  Top 0.15: U12.3 R78.2 R79.2
N$90
  Top 0.15: R81.2 203.25,27.75 203.5,27.75 R80.2 U12.2
N$91
  Top 0.15: R78.1 C67.2 200.38,25.88 200,26.25 199.25,26.25 198.62,25.62 198.62,23.62 200.5,21.75 208.38,21.75 208.75,21.38 208.75,20.62 209.38,20 C71.2
N$92
  Top 0.15: R80.1 C68.2 200.5,27.12 200,26.62 199.12,26.62 198.25,25.75 198.25,23.5 200.38,21.38 208.25,21.38 208.38,21.25 208.38,20.62 207.75,20 C72.2
N$93
  Top 0.15: 212.55,17.55 212.56,17.56
  Top 0.5: 212.56,17.56 C71.1 | CN12.2 212.55,17.55
N$94
  Top 0.15: 208.5,13.88 208.5,14
  Top 0.5: 208.5,14 208.5,15.88 204.38,20 C72.1 | CN12.3 208.5,13.88
N$95
  Top 0.15: U12.6 R82.1 213.5,26.5 213.75,26.5 R83.2
N$96
  Top 0.15: R84.2 U12.5
N$105
  Top 0.15: U14.3 R92.2 R93.2
N$106
  Top 0.15: R95.2 242.25,27.75 242.5,27.75 R94.2 U14.2
N$107
  Top 0.15: R92.1 C79.2 239.38,25.88 239,26.25 238.25,26.25 237.62,25.62 237.62,23.62 239.5,21.75 247.38,21.75 247.75,21.38 247.75,20.62 248.38,20 C83.2
N$108
  Top 0.15: R94.1 C80.2 239.5,27.12 239,26.62 238.12,26.62 237.25,25.75 237.25,23.5 239.38,21.38 247.25,21.38 247.38,21.25 247.38,20.62 246.75,20 C84.2
N$109
  Top 0.15: 251.55,17.55 251.56,17.56
  Top 0.5: 251.56,17.56 C83.1 | CN14.2 251.55,17.55
N$110
  Top 0.15: 247.5,13.88 247.5,14
  Top 0.5: 247.5,14 247.5,15.88 243.38,20 C84.1 | CN14.3 247.5,13.88
N$111
  Top 0.15: U14.6 R96.1 252.5,26.5 252.75,26.5 R97.2
N$112
  Top 0.15: R98.2 U14.5
N$121
  Top 0.15: U16.3 R106.2 R107.2
N$122
  Top 0.15: R109.2 281.25,27.75 281.5,27.75 R108.2 U16.2
N$123
  Top 0.15: R106.1 C91.2 278.38,25.88 278,26.25 277.25,26.25 276.62,25.62 276.62,23.62 278.5,21.75 286.38,21.75 286.75,21.38 286.75,20.62 287.38,20 C95.2
N$124
  Top 0.15: R108.1 C92.2 278.5,27.12 278,26.62 277.12,26.62 276.25,25.75 276.25,23.5 278.38,21.38 286.25,21.38 286.38,21.25 286.38,20.62 285.75,20 C96.2
N$125
  Top 0.15: 290.55,17.55 290.56,17.56
  Top 0.5: 290.56,17.56 C95.1 | CN16.2 290.55,17.55
N$126
  Top 0.15: 286.5,13.88 286.5,14
  Top 0.5: 286.5,14 286.5,15.88 282.38,20 C96.1 | CN16.3 286.5,13.88
N$127
  Top 0.15: U16.6 R110.1 291.5,26.5 291.75,26.5 R111.2
N$128
  Top 0.15: R112.2 U16.5
V+  (via drill 0.5)
  Top 0.5: U1.8 16.57,28.38 16.62,28.43 C5.2 20.88,29.62 v24.5,26 | U4.8 55.58,28.38 55.62,28.43 C21.2 60.38,29.62 v64.5,25.5 | U6.8 94.58,28.38 94.62,28.43 C33.2 99.38,29.62 v104,25 | U8.8 133.57,28.38 133.62,28.43 C45.2 138.38,29.62 v143.5,24.5 | U10.8 172.57,28.38 172.62,28.43 C57.2 177.38,29.62 v182,25 | U12.8 211.57,28.38 211.62,28.43 C69.2 216.38,29.62 v221.5,24.5 | U14.8 250.57,28.38 250.62,28.43 C81.2 254.88,29.62 v260,24.5 | U16.8 289.57,28.38 289.62,28.43 C93.2 290.62,29.62 293.88,29.62 v298,25.5 | 22,10 v22,13 | v24,13 24,20.5 22,22.5 22,23.5 v22.5,24 | v62.5,8 v62.5,23.5 | v102,8 v102,23 | v141.5,8 v141.5,22.5 | v180,8 v180,23 | v219.5,8 v219.5,22.5 | v259,8 v259,22 | v303,20.5 299,20.5 v296,23.5
  Top 1: U2.3 325,17.5 v303,17.5 301.5,17.5 289,5 v259,5 v219.5,5 v180,5 v141.5,5 v102,5 v62.5,5 27,5 22,10
  Bottom 0.5: v22,13 v24,13 | v22.5,24 v24.5,26 | v62.5,5 v62.5,8 | v62.5,23.5 v64.5,25.5 | v102,5 v102,8 | v102,23 v104,25 | v141.5,5 v141.5,8 | v141.5,22.5 v143.5,24.5 | v180,5 v180,8 | v180,23 v182,25 | v219.5,5 v219.5,8 | v219.5,22.5 v221.5,24.5 | v259,5 v259,8 | v259,22 259,23.5 v260,24.5 | v303,17.5 v303,20.5 | v296,23.5 v298,25.5
V-
  Top 0.5: U1.4 10.43,24.62 10.38,24.57 C6.2 11.25,22.5 20.5,22.5 23,20 23,11 | U4.4 49.42,24.62 49.38,24.57 C22.2 50.25,22.5 59.5,22.5 61.5,20.5 61.5,6.5 | U6.4 88.42,24.62 88.38,24.57 C34.2 89.25,22.5 98,22.5 101,19.5 101,6.5 | U8.4 127.42,24.62 127.38,24.57 C46.2 128.25,22.5 137.5,22.5 140.5,19.5 140.5,6.5 | U10.4 166.43,24.62 166.38,24.57 C58.2 167.25,22.5 176.5,22.5 179,20 179,6.5 | U12.4 205.43,24.62 205.38,24.57 C70.2 206.25,22.5 216,22.5 218.5,20 218.5,6.5 | U14.4 244.43,24.62 244.38,24.57 C82.2 245.25,22.5 255.5,22.5 258,20 258,6.5 | U16.4 283.43,24.62 283.38,24.57 C94.2 284.25,22.5 293.5,22.5 299,17
  Top 1: U2.5 306.18,19 301,19 299,17 288.5,6.5 258,6.5 218.5,6.5 179,6.5 140.5,6.5 101,6.5 62.5,6.5 61.5,6.5 27.5,6.5 23,11
VOUT_N_1
  Top 0.15: R13.1 U1.7
  Top 0.5: TP6.1 28.5,27 30.31,25.19 31.81,25.19 32.62,24.38 32.62,23.62 32.38,23.38 25.88,23.38 21.12,28.12 18.88,28.12 R13.1
VOUT_N_3
  Top 0.15: R27.1 U4.7
  Top 0.5: TP12.1 67.5,27 69.31,25.19 70.81,25.19 71.62,24.38 71.62,23.62 71.38,23.38 64.88,23.38 60.12,28.12 57.88,28.12 R27.1
VOUT_N_5
  Top 0.15: R41.1 U6.7
  Top 0.5: TP18.1 106.5,27 108.31,25.19 109.81,25.19 110.62,24.38 110.62,23.62 110.38,23.38 103.88,23.38 99.12,28.12 96.88,28.12 R41.1
VOUT_N_7
  Top 0.15: R55.1 U8.7
  Top 0.5: TP24.1 145.5,27 147.31,25.19 148.81,25.19 149.62,24.38 149.62,23.62 149.38,23.38 142.88,23.38 138.12,28.12 135.88,28.12 R55.1
VOUT_N_9
  Top 0.15: R69.1 U10.7
  Top 0.5: TP30.1 184.5,27 186.31,25.19 187.81,25.19 188.62,24.38 188.62,23.62 188.38,23.38 181.88,23.38 177.12,28.12 174.88,28.12 R69.1
VOUT_N_11
  Top 0.15: R83.1 U12.7
  Top 0.5: TP36.1 223.5,27 225.31,25.19 226.81,25.19 227.62,24.38 227.62,23.62 227.38,23.38 220.88,23.38 216.12,28.12 213.88,28.12 R83.1
VOUT_N_13
  Top 0.15: R97.1 U14.7
  Top 0.5: TP42.1 262.5,27 264.31,25.19 265.81,25.19 266.62,24.38 266.62,23.62 266.38,23.38 259.88,23.38 255.12,28.12 252.88,28.12 R97.1
VOUT_N_15
  Top 0.15: R111.1 U16.7
  Top 0.5: TP48.1 301.5,27 303.31,25.19 304.81,25.19 305.62,24.38 305.62,23.62 305.38,23.38 298.88,23.38 294.12,28.12 291.88,28.12 R111.1
VOUT_P_1
  Top 0.15: R11.1 U1.1 12.12,28.38 15.25,25.25 18.75,25.25 R12.2
  Top 0.5: TP4.1 37.5,27 35.69,25.19 34.19,25.19 33.38,24.38 33.38,23.25 32.75,22.62 25.62,22.62 22.38,25.88 R12.2
VOUT_P_3
  Top 0.15: R25.1 U4.1 51.12,28.38 54.25,25.25 57.75,25.25 R26.2
  Top 0.5: TP10.1 76.5,27 74.69,25.19 73.19,25.19 72.38,24.38 72.38,23.25 71.75,22.62 64.62,22.62 61.38,25.88 R26.2
VOUT_P_5
  Top 0.15: R39.1 U6.1 90.12,28.38 93.25,25.25 96.75,25.25 R40.2
  Top 0.5: TP16.1 115.5,27 113.69,25.19 112.19,25.19 111.38,24.38 111.38,23.25 110.75,22.62 103.62,22.62 100.38,25.88 R40.2
VOUT_P_7
  Top 0.15: R53.1 U8.1 129.12,28.38 132.25,25.25 135.75,25.25 R54.2
  Top 0.5: TP22.1 154.5,27 152.69,25.19 151.19,25.19 150.38,24.38 150.38,23.25 149.75,22.62 142.62,22.62 139.38,25.88 R54.2
VOUT_P_9
  Top 0.15: R67.1 U10.1 168.12,28.38 171.25,25.25 174.75,25.25 R68.2
  Top 0.5: TP28.1 193.5,27 191.69,25.19 190.19,25.19 189.38,24.38 189.38,23.25 188.75,22.62 181.62,22.62 178.38,25.88 R68.2
VOUT_P_11
  Top 0.15: R81.1 U12.1 207.12,28.38 210.25,25.25 213.75,25.25 R82.2
  Top 0.5: TP34.1 232.5,27 230.69,25.19 229.19,25.19 228.38,24.38 228.38,23.25 227.75,22.62 220.62,22.62 217.38,25.88 R82.2
VOUT_P_13
  Top 0.15: R95.1 U14.1 246.12,28.38 249.25,25.25 252.75,25.25 R96.2
  Top 0.5: TP40.1 271.5,27 269.69,25.19 268.19,25.19 267.38,24.38 267.38,23.25 266.75,22.62 259.62,22.62 256.38,25.88 R96.2
VOUT_P_15
  Top 0.15: R109.1 U16.1 285.12,28.38 288.25,25.25 291.75,25.25 R110.2
  Top 0.5: TP46.1 310.5,27 308.69,25.19 307.19,25.19 306.38,24.38 306.38,23.25 305.75,22.62 298.62,22.62 295.38,25.88 R110.2